# Altium project pre_adc_circuit.PrjPcb
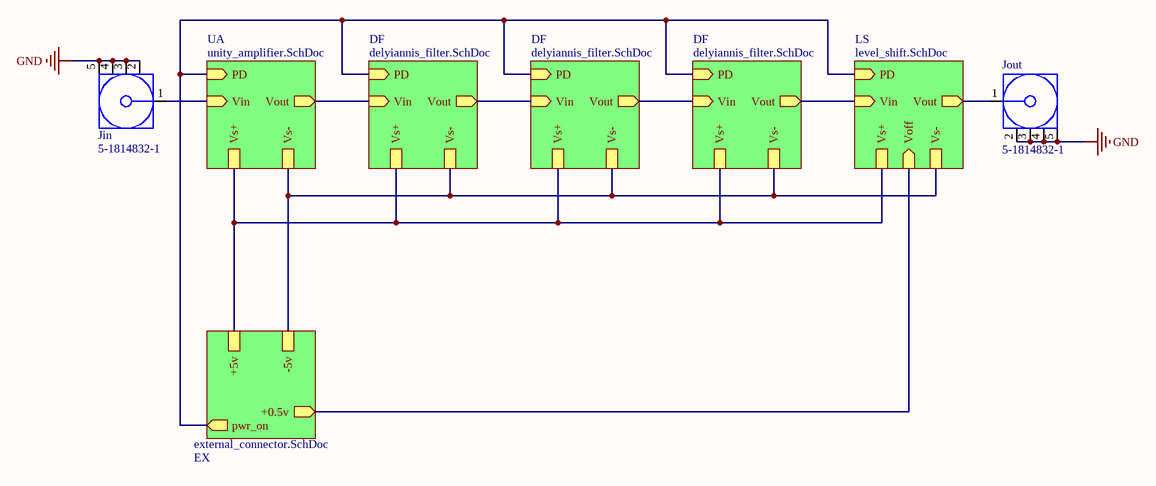
[diagram p0: main.SchDoc]
5 sheets, 46 parts. Net scope: hierarchical (ports join the sheet entries above them; power ports are global).
Board files: pre_adc_pcb.PcbDoc, pre_adc_pcb2.PcbDoc
Sheets:
  main.SchDoc
    UA = unity_amplifier.SchDoc
    DF = delyiannis_filter.SchDoc
    DF = delyiannis_filter.SchDoc
    DF = delyiannis_filter.SchDoc
    LS = level_shift.SchDoc
    EX = external_connector.SchDoc

## Sheet main.SchDoc
size A4; SheetNumber: 1; SheetTotal: 5

### Parts
Jin  5-1814832-1  [TECO-5-1814832-1_V]
Jout  5-1814832-1  [TECO-5-1814832-1_V]

### Sub-sheets
DF = delyiannis_filter.SchDoc: Vs+, PD (in), Vin (in), Vs-, Vout (out)
DF = delyiannis_filter.SchDoc: Vs+, PD (in), Vin (in), Vs-, Vout (out)
DF = delyiannis_filter.SchDoc: Vs+, PD (in), Vin (in), Vs-, Vout (out)
EX = external_connector.SchDoc: +5v, -5v, pwr_on (out), +0.5v (out)
LS = level_shift.SchDoc: Vs+, PD (in), Vin (in), Vs-, Vout (out), Voff (in)
UA = unity_amplifier.SchDoc: Vs+, PD (in), Vin (in), Vs-, Vout (out)

### Nets
GND: Jin.2 Jin.3 Jin.4 Jin.5 Jout.2 Jout.3 Jout.4 Jout.5
+0.5v: sheet LS/Voff, sheet EX/+0.5v
+5v: sheet UA/Vs+, sheet DF/Vs+, sheet DF/Vs+, sheet DF/Vs+, sheet LS/Vs+, sheet EX/+5v
-5v: sheet UA/Vs-, sheet DF/Vs-, sheet DF/Vs-, sheet DF/Vs-, sheet LS/Vs-, sheet EX/-5v
pwr_on: sheet UA/PD, sheet DF/PD, sheet DF/PD, sheet DF/PD, sheet LS/PD, sheet EX/pwr_on
NetJin_1: Jin.1 ; sheet UA/Vin
NetJout_1: Jout.1 ; sheet LS/Vout
NetOPA855_DF1_6: sheet DF/Vout, sheet LS/Vin
NetOPA855_DF2_6: sheet DF/Vout, sheet DF/Vin
NetOPA855_DF3_6: sheet DF/Vout, sheet DF/Vin
NetOPA855_UA_6: sheet UA/Vout, sheet DF/Vin

### Library data of the parts
Jin Jout = CMP-2000-05415-1: SMA Connector, Pitch 5.08 mm, 1 Position, Height 9.5 mm, Tail Length 4 mm, -65 to 165 degC, RoHS, Bulk; Manufacturer: TE Connectivity; Connector Mounting: PCBMount; Connector Body Style: StraightJack; Impedance: 50ohm; Coaxial Termination: Solder; SVHC: NoSVHC(15-Jun-2015); Frequency Max: 3GHz; Product Range: ZDCSeries; Connector Type: SMACoaxial; Datasheet Version: Rev. B1, 03/2011; Package Reference: 5-1814832-1; Package Description: SMA Connector, Pitch 5.08 mm, 1 Position, Height 9.5 mm, Tail Length 4 mm; Contact Plating: GoldPlatedContacts; Coaxial Cable Types: -; Contact Material: BerylliumCopper; Manufacturer URL: http://www.te.com/; Datasheet URL: http://www.onlinecomponents.com/productFiles/mf-AMP/eng_cd_1814832_a.pdf

## Sheet unity_amplifier.SchDoc
size A4; SheetNumber: 2; SheetTotal: 5
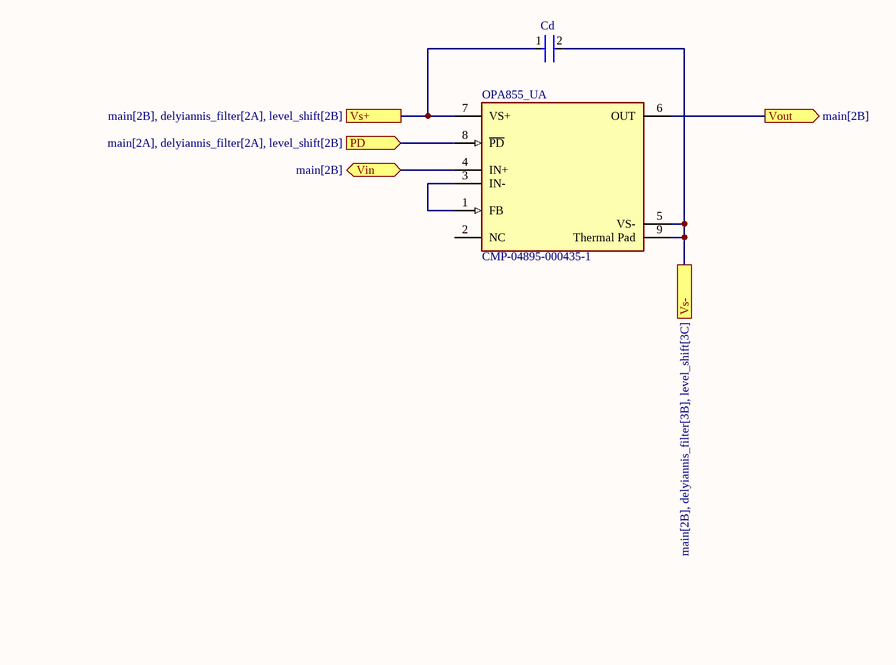
[diagram p1: unity_amplifier.SchDoc]

### Parts
Cd  C0402C104K4RACTU  [FP-C0402-BB-MFG]  (value not drawn)
OPA855_UA  CMP-04895-000435-1  [FP-DSG0008A-MFG]

### Ports
PD (in, see main[2A], delyiannis_filter[2A], level_shift[2B]), Vin (bidir, see main[2B]), Vout (out, see main[2B]), Vs+ (see main[2B], delyiannis_filter[2A], level_shift[2B]), Vs- (see main[2B], delyiannis_filter[3B], level_shift[3C])

### Nets
+5v: Cd.1 OPA855_UA.7(VS+) ; port Vs+
-5v: Cd.2 OPA855_UA.5(VS-) OPA855_UA.9(Thermal_Pad) ; port Vs-
pwr_on: OPA855_UA.8(~{PD}) ; port PD
NetJin_1: OPA855_UA.4(IN+) ; port Vin
NetOPA855_UA_1: OPA855_UA.1(FB) OPA855_UA.3(IN-)
NetOPA855_UA_6: OPA855_UA.6(OUT) ; port Vout

Not connected (* = marked no-connect by the designer): OPA855_UA 2(NC)

### Library data of the parts
Cd = CMP-2008-02108-2: CAP CER 0.1UF 16V X7R 0402; Manufacturer: Kemet; Value: 0.10 μF; Tolerance: 0.1; Temperature Coefficient: 15%; Voltage Rating: 16 V; Package: C0402-BB; Automotive: No; Ipc Land Pattern Name: CAPC10050X50; Device Class L3: Ceramic Capacitors; Capacitance: 0.10 μF; Octopart: https://octopart.com/c0402c104k4ractu-kemet-94158; Temperature Characteristic: X7R; Mouser Description: Cap Ceramic 0.1uF 16V X7R 10% SMD 0402 125?C Paper T/R - Tape and Reel (Alt: C0402C104K4RAC TU); ComponentLink2Description: Datasheet; Temperature Range Low: -55°C; RoHS: TRUE; Device Class L1: Passive Components; Manufacturer Part Number: C0402C104K4RACTU; Material: Ceramic; Temperature Range High: +125°C; Device Class L2: Capacitors; ComponentLink2URL: https://content.kemet.com/datasheets/KEM_C1002_X7R_SMD.pdf; Category: Cap; Height: 0.55mm; Temperature: -55°C to +125°C; Lead Free: Yes; Digikey Description: CAP CER 0.1UF 16V X7R 0402
OPA855_UA = CMP-007-000000-2: IC OPAMP GP 1 CIRCUIT 8WSON; Source: Components - 05.10.22 - 21.23.SchLib; RoHS Compliant: Yes; Design Item ID: CMP-04895-000435-1

## Sheet delyiannis_filter.SchDoc
size A4; SheetNumber: 3; SheetTotal: 5
Used 3 times, as channels DF, DF, DF. Parts and nets are listed once, with the designators drawn on the sheet.
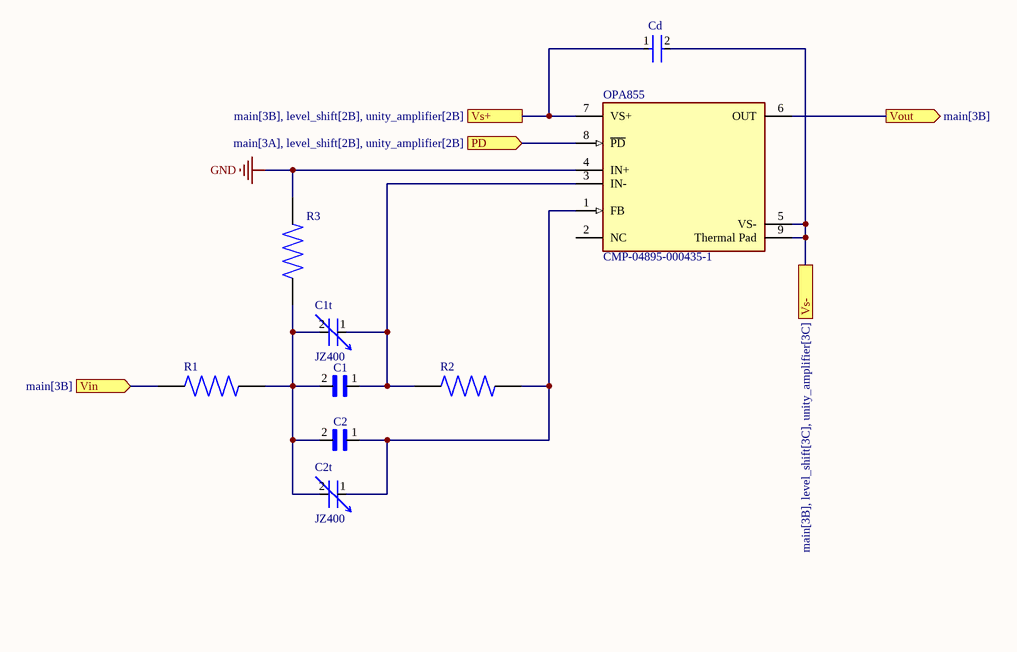
[diagram p2: delyiannis_filter.SchDoc]

### Parts
C1  CC0402BRNPO9BN8R2  [CAPC1005X55N]  (value not drawn)
C1t  JZ400  [FP-JZ400-MFG]
C2  CC0402BRNPO9BN8R2  [CAPC1005X55N]  (value not drawn)
C2t  JZ400  [FP-JZ400-MFG]
Cd  C0402C104K4RACTU  [FP-C0402-BB-MFG]  (value not drawn)
OPA855  CMP-04895-000435-1  [FP-DSG0008A-MFG]
R1  RN73H1ETTP26R4F50  [RESC1005X40N]  (value not drawn)
R2  RC0603FR-0753R6L  [RESC1608X55N]  (value not drawn)
R3  RMCF0603FT634R  [RESC1508X55N]  (value not drawn)

### Ports
PD (in, see main[3A], level_shift[2B], unity_amplifier[2B]), Vin (in, see main[3B]), Vout (out, see main[3B]), Vs+ (see main[3B], level_shift[2B], unity_amplifier[2B]), Vs- (see main[3B], level_shift[3C], unity_amplifier[3C])

### Nets
GND: OPA855.4(IN+) R3.1
PD: OPA855.8(~{PD}) ; port PD
Vin: R1.1 ; port Vin
Vout: OPA855.6(OUT) ; port Vout
Vs+: Cd.1 OPA855.7(VS+) ; port Vs+
Vs-: Cd.2 OPA855.5(VS-) OPA855.9(Thermal_Pad) ; port Vs-
NetC1_1: C1.1 C1t.1(HOT) OPA855.3(IN-) R2.1
NetC1_2: C1.2 C1t.2(COLD) C2.2 C2t.2(COLD) R1.2 R3.2
NetC2_1: C2.1 C2t.1(HOT) OPA855.1(FB) R2.2

Not connected (* = marked no-connect by the designer): OPA855 2(NC)

### Channels
DF: designators end in _DF3; ports PD=pwr_on Vin=NetOPA855_UA_6 Vout=NetOPA855_DF3_6 Vs+=+5v Vs-=-5v
DF: designators end in _DF2; ports PD=pwr_on Vin=NetOPA855_DF3_6 Vout=NetOPA855_DF2_6 Vs+=+5v Vs-=-5v
DF: designators end in _DF1; ports PD=pwr_on Vin=NetOPA855_DF2_6 Vout=NetOPA855_DF1_6 Vs+=+5v Vs-=-5v

### Library data of the parts
C1 C2 = CC0402BRNPO9BN8R2: KC 8,2pF 0402 0,10pF 50V NP0; Package: None; Price: None; Value: *; MP: CC0402BRNPO9BN8R2; Availability: Unavailable
C1t C2t = CMP-249250-000001-1: CAP TRIMMER 8-40PF 125V SMD; Dielectric Material: Ceramic; Tolerance: 100%; Capacitance: 0.00000000004F; Test Frequency: 1MHz; Q Factor: 1500; Voltage Rating: 125V; Resistor Type: Ceramic; Height: 1.5mm; Features: General Purpose; Min Operating Temperature: -40°C; Max Operating Temperature: 85°C; RoHS Compliant: Yes; Length: 4.5mm; Width: 3.2mm; Packaging: Cut Tape; Mount: Surface Mount; Series: JZ; Termination: SMD/SMT
Cd = CMP-2008-02108-2: as Cd on sheet unity_amplifier; Voltage Rating: 16 V; Package: C0402-BB; Automotive: No; Ipc Land Pattern Name: CAPC10050X50; Device Class L3: Ceramic Capacitors; Capacitance: 0.10 μF; Octopart: https://octopart.com/c0402c104k4ractu-kemet-94158; Temperature Characteristic: X7R; Mouser Description: Cap Ceramic 0.1uF 16V X7R 10% SMD 0402 125?C Paper T/R - Tape and Reel (Alt: C0402C104K4RAC TU); ComponentLink2Description: Datasheet; Temperature Range Low: -55°C; RoHS: TRUE; Device Class L1: Passive Components; Manufacturer Part Number: C0402C104K4RACTU; Material: Ceramic; Temperature Range High: +125°C; Device Class L2: Capacitors; ComponentLink2URL: https://content.kemet.com/datasheets/KEM_C1002_X7R_SMD.pdf; Category: Cap; Height: 0.55mm; Temperature: -55°C to +125°C; Lead Free: Yes; Digikey Description: CAP CER 0.1UF 16V X7R 0402
OPA855 = CMP-007-000000-2: IC OPAMP GP 1 CIRCUIT 8WSON; Source: Components - 05.10.22 - 21.23.SchLib; RoHS Compliant: Yes; Design Item ID: CMP-04895-000435-1
R2 = RC0603FR-0753R6L: Res Thick Film 0603 53.6 Ohm 1% 0.1W(1/10W) ?100ppm/?C Molded SMD Paper T/R; Package: None; Price: None; Value: *; MP: RC0603FR-0753R6L; Availability: Unavailable
R1 = RN73H1ETTP26R4F50: Package: None; Price: None; Value: *; MP: RN73H1ETTP26R4F50; Availability: Unavailable
R3 = RMCF0603FT634R: Package: None; Price: None; Value: *; MP: RMCF0603FT634R; Availability: Unavailable

## Sheet level_shift.SchDoc
size A4; SheetNumber: 4; SheetTotal: 5
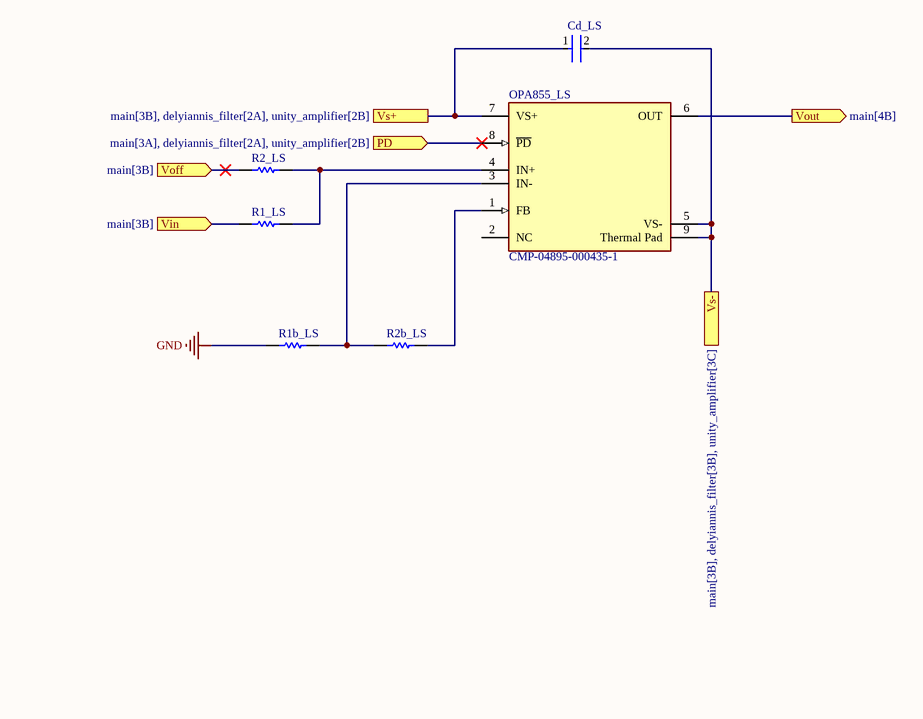
[diagram p3: level_shift.SchDoc]

### Parts
Cd_LS  C0402C104K4RACTU  [FP-C0402-BB-MFG]  (value not drawn)
OPA855_LS  CMP-04895-000435-1  [FP-DSG0008A-MFG]
R1_LS  RC0402FR-07100RL  [RESC1005X40X25ML05T10]  (value not drawn)
R1b_LS  RC0402FR-07100RL  [RESC1005X40X25ML05T10]  (value not drawn)
R2_LS  RC0402FR-07100RL  [RESC1005X40X25ML05T10]  (value not drawn)
R2b_LS  RC0402FR-07100RL  [RESC1005X40X25ML05T10]  (value not drawn)

### Ports
PD (in, see main[3A], delyiannis_filter[2A], unity_amplifier[2B]), Vin (in, see main[3B]), Voff (in, see main[3B]), Vout (out, see main[4B]), Vs+ (see main[3B], delyiannis_filter[2A], unity_amplifier[2B]), Vs- (see main[3B], delyiannis_filter[3B], unity_amplifier[3C])

### Nets
GND: R1b_LS.1
+0.5v: R2_LS.1 ; port Voff
+5v: Cd_LS.1 OPA855_LS.7(VS+) ; port Vs+
-5v: Cd_LS.2 OPA855_LS.5(VS-) OPA855_LS.9(Thermal_Pad) ; port Vs-
pwr_on: OPA855_LS.8(~{PD}) ; port PD
NetJout_1: OPA855_LS.6(OUT) ; port Vout
NetOPA855_DF1_6: R1_LS.1 ; port Vin
NetOPA855_LS_1: OPA855_LS.1(FB) R2b_LS.2
NetOPA855_LS_3: OPA855_LS.3(IN-) R1b_LS.2 R2b_LS.1
NetOPA855_LS_4: OPA855_LS.4(IN+) R1_LS.2 R2_LS.2

Not connected (* = marked no-connect by the designer): OPA855_LS 2(NC)

### Library data of the parts
Cd_LS = CMP-2008-02108-2: as Cd on sheet unity_amplifier; Voltage Rating: 16 V; Package: C0402-BB; Automotive: No; Ipc Land Pattern Name: CAPC10050X50; Device Class L3: Ceramic Capacitors; Capacitance: 0.10 μF; Octopart: https://octopart.com/c0402c104k4ractu-kemet-94158; Temperature Characteristic: X7R; Mouser Description: Cap Ceramic 0.1uF 16V X7R 10% SMD 0402 125?C Paper T/R - Tape and Reel (Alt: C0402C104K4RAC TU); ComponentLink2Description: Datasheet; Temperature Range Low: -55°C; RoHS: TRUE; Device Class L1: Passive Components; Manufacturer Part Number: C0402C104K4RACTU; Material: Ceramic; Temperature Range High: +125°C; Device Class L2: Capacitors; ComponentLink2URL: https://content.kemet.com/datasheets/KEM_C1002_X7R_SMD.pdf; Category: Cap; Height: 0.55mm; Temperature: -55°C to +125°C; Lead Free: Yes; Digikey Description: CAP CER 0.1UF 16V X7R 0402
OPA855_LS = CMP-007-000000-2: IC OPAMP GP 1 CIRCUIT 8WSON; Source: Components - 05.10.22 - 21.23.SchLib; RoHS Compliant: Yes; Design Item ID: CMP-04895-000435-1
R1_LS R1b_LS R2_LS R2b_LS = CMP-2002-07344-1: Manufacturer: Yageo / Phycomp; Part Number: RC0402FR-07100RL

## Sheet external_connector.SchDoc
size A4; SheetNumber: 5; SheetTotal: 5
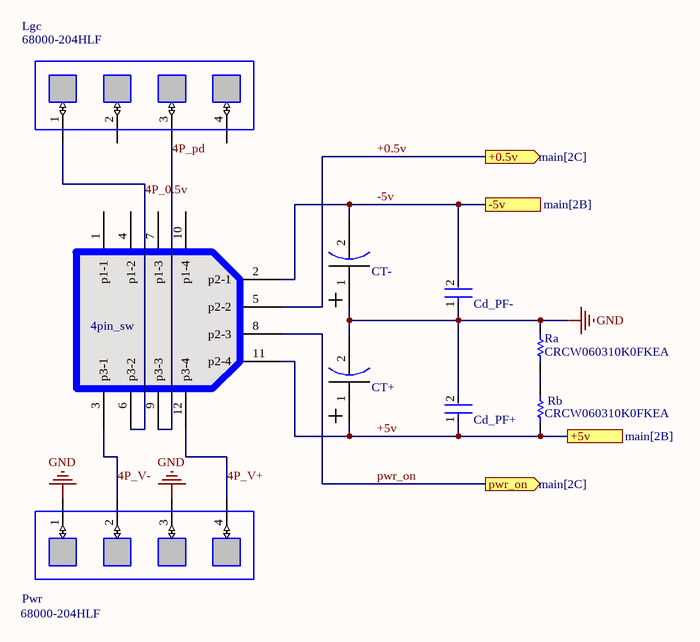
[diagram p4: external_connector.SchDoc]

### Parts
4pin_sw  1004P3T2B4M7QE  [1004P3T2B4M7QE-Footprint-1]  (value not drawn)
Cd_PF+  C0402C104K4RACTU  [FP-C0402-BB-MFG]  (value not drawn)
Cd_PF-  C0402C104K4RACTU  [FP-C0402-BB-MFG]  (value not drawn)
CT+  597D107X0040H2T  [597D107X0040H2T-Footprint-1]  (value not drawn)
CT-  597D107X0040H2T  [597D107X0040H2T-Footprint-1]  (value not drawn)
Lgc  68000-204HLF  [68000-204HLF-Footprint-1]
Pwr  68000-204HLF  [68000-204HLF-Footprint-1]
Ra  CRCW060310K0FKEA  [RESC1609X50X30NL8T20]
Rb  CRCW060310K0FKEA  [RESC1609X50X30NL8T20]

### Ports
+0.5v (out, see main[2C]), +5v (see main[2B]), -5v (see main[2B]), pwr_on (out, see main[2C])

### Nets
GND: Cd_PF+.2 Cd_PF-.1 CT+.2(neg) CT-.1(pos) Pwr.1(pin1) Pwr.3(pin1) Ra.1
4P_0.5v: 4pin_sw.6(p3-2) Lgc.1(pin1)
4P_pd: 4pin_sw.9(p3-3) Lgc.3(pin1)
4P_V+: 4pin_sw.12(p3-4) Pwr.4(pin1)
4P_V-: 4pin_sw.3(p3-1) Pwr.2(pin1)
+0.5v: 4pin_sw.5(p2-2) ; port +0.5v
+5v: 4pin_sw.11(p2-4) Cd_PF+.1 CT+.1(pos) Rb.2 ; port +5v
-5v: 4pin_sw.2(p2-1) Cd_PF-.2 CT-.2(neg) ; port -5v
pwr_on: 4pin_sw.8(p2-3) ; port pwr_on
NetRa_2: Ra.2 Rb.1

Not connected (* = marked no-connect by the designer): 4pin_sw 1(p1-1) 4(p1-2) 7(p1-3) 10(p1-4); Lgc 2(pin1) 4(pin1)

### Library data of the parts
4pin_sw = CMP-00001-7: ESWCH 1004P3T2B4M7QE Switches > Toggle > Mini Toggle Switch; Actuator Type: Standard Round; Current Rating: 5A; Electrical Life: 40000Cycles; Voltage Rating (AC): 120V; Illumination Type: Non-Illuminated; Switch Function: On-Off-On; Voltage Rating (DC): 28V; Actuator Length: 6.46mm; Actuator Material: Brass,Chrome; Throw Configuration: 4PDT; Series: 100; Mount: Through Hole,Vertical; Min Operating Temperature: -30°C; Max Operating Temperature: 85°C; Packaging: Bulk; Package Quantity: 1; RoHS Compliant: No; Termination: PC Pin
Cd_PF+ Cd_PF- = CMP-2008-02108-2: as Cd on sheet unity_amplifier; Voltage Rating: 16 V; Package: C0402-BB; Automotive: No; Ipc Land Pattern Name: CAPC10050X50; Device Class L3: Ceramic Capacitors; Capacitance: 0.10 μF; Octopart: https://octopart.com/c0402c104k4ractu-kemet-94158; Temperature Characteristic: X7R; Mouser Description: Cap Ceramic 0.1uF 16V X7R 10% SMD 0402 125?C Paper T/R - Tape and Reel (Alt: C0402C104K4RAC TU); ComponentLink2Description: Datasheet; Temperature Range Low: -55°C; RoHS: TRUE; Device Class L1: Passive Components; Manufacturer Part Number: C0402C104K4RACTU; Material: Ceramic; Temperature Range High: +125°C; Device Class L2: Capacitors; ComponentLink2URL: https://content.kemet.com/datasheets/KEM_C1002_X7R_SMD.pdf; Category: Cap; Height: 0.55mm; Temperature: -55°C to +125°C; Lead Free: Yes; Digikey Description: CAP CER 0.1UF 16V X7R 0402
CT+ CT- = CMP-00002-5: Solid Tantalum Chip Capacitors, Ultra-Low ESR, Conformal Coated, Maximum CV; RoHS Compliant: Yes
Lgc Pwr = CMP-00000-2: Conn Unshrouded Header HDR 4 POS 2.54mm Solder ST Top Entry Thru-Hole BergStik® Bulk
Ra Rb = CMP-1666-00005-4: Chip Resistor, 10 KOhm, +/- 1%, 100 mW, -55 to 155 degC, 0603 (1608 Metric), RoHS, Tape and Reel; Manufacturer: Vishay Semiconductor; Voltage Rating: 75 V; Max Operating Temperature: 155 degC; PackageDescription: 2-Pin Surface Mount Device, Body 1.575 x 0.85 mm; ComponentLink1Description: Manufacturer URL; RoHSCompliant: true; PackageReference: 0603; REACH SVHC: Unknown; Length: 1.55 mm; DatasheetVersion: 06/2012; Packaging: Tape and Reel; Min Operating Temperature: -55 degC; Mounting Technology: Surface Mount; ComponentLink2URL: https://datasheet.ciiva.com/11809/0900766b80d98afc-11809037.pdf; Height: 0.45 mm; ComponentLink2Description: Datasheet; Package Quantity: 5000; ComponentLink1URL: http://www.vishay.com/

## Nets that join several sheets
GND: main (8 pins), DF (OPA855_DF3.4 R3_DF3.1), DF (OPA855_DF2.4 R3_DF2.1), DF (OPA855_DF1.4 R3_DF1.1), level_shift (R1b_LS.1), external_connector (7 pins)
+0.5v: level_shift (R2_LS.1), external_connector (4pin_sw.5)
+5v: unity_amplifier (Cd.1 OPA855_UA.7), DF (Cd_DF3.1 OPA855_DF3.7), DF (Cd_DF2.1 OPA855_DF2.7), DF (Cd_DF1.1 OPA855_DF1.7), level_shift (Cd_LS.1 OPA855_LS.7), external_connector (4pin_sw.11 Cd_PF+.1 CT+.1 Rb.2)
-5v: unity_amplifier (Cd.2 OPA855_UA.5 OPA855_UA.9), DF (Cd_DF3.2 OPA855_DF3.5 OPA855_DF3.9), DF (Cd_DF2.2 OPA855_DF2.5 OPA855_DF2.9), DF (Cd_DF1.2 OPA855_DF1.5 OPA855_DF1.9), level_shift (Cd_LS.2 OPA855_LS.5 OPA855_LS.9), external_connector (4pin_sw.2 Cd_PF-.2 CT-.2)
NetJin_1: main (Jin.1), unity_amplifier (OPA855_UA.4)
NetJout_1: main (Jout.1), level_shift (OPA855_LS.6)
NetOPA855_DF1_6: DF (OPA855_DF1.6), level_shift (R1_LS.1)
NetOPA855_DF2_6: DF (OPA855_DF2.6), DF (R1_DF1.1)
NetOPA855_DF3_6: DF (OPA855_DF3.6), DF (R1_DF2.1)
NetOPA855_UA_6: unity_amplifier (OPA855_UA.6), DF (R1_DF3.1)
pwr_on: unity_amplifier (OPA855_UA.8), DF (OPA855_DF3.8), DF (OPA855_DF2.8), DF (OPA855_DF1.8), level_shift (OPA855_LS.8), external_connector (4pin_sw.8)